# Altium schematic sheet 8_imu&debug_conn.SchDoc
size 431 x 279 mm; Organization: ORGANIZATION; Address1: ADDRESS 1; Address2: ADDRESS 2; Address3: ADDRESS 3; Address4: ADDRESS 4; Revision: -; ENG_APP_DATE: --/--/--; DSN_APP_DATE: --/--/--; CHK_APP_DATE: --/--/--
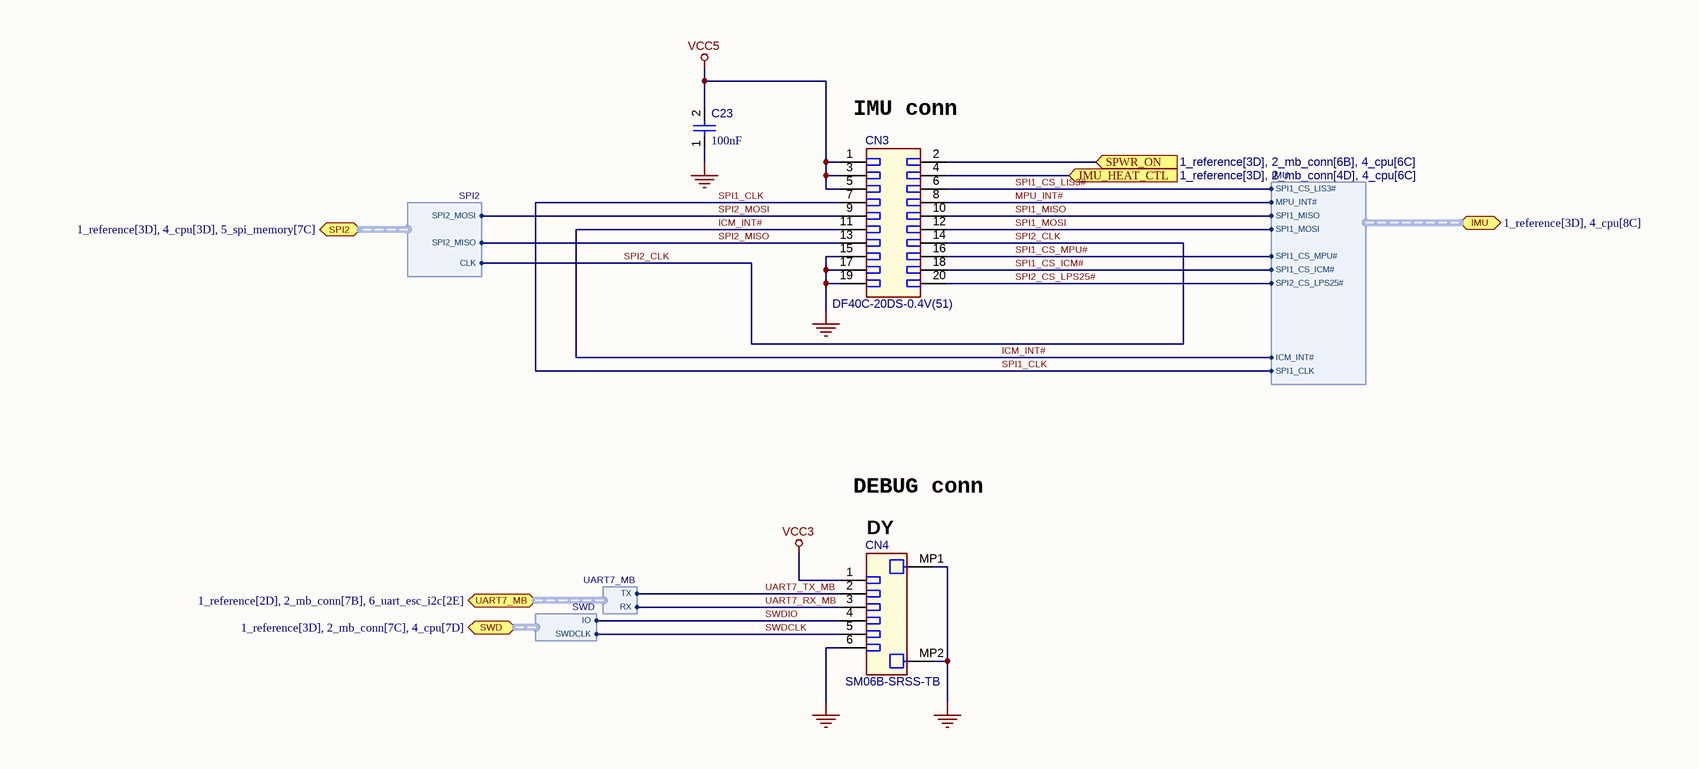
[diagram p0: 8_imu&debug_conn.SchDoc]

## Parts
C23  value 100nF  [CAPC0402(1005)60_L]  (hidden comment: Capacitor 100nF +/-20% 10V 0402)
CN3  DF40C-20DS-0.4V(51)  [HIRO-DF40C-20DS-0.4V(51)_V]
CN4  SM06B-SRSS-TB  [JST-SM06B-SRSS-TB_V]

## Ports
IMU (bidir, harness IMU, see 1_reference[3D], 4_cpu[8C]), IMU_HEAT_CTL (in, see 1_reference[3D], 2_mb_conn[4D], 4_cpu[6C]), SPI2 (bidir, harness SPI2, see 1_reference[3D], 4_cpu[3D], 5_spi_memory[7C]), SPWR_ON (in, see 1_reference[3D], 2_mb_conn[6B], 4_cpu[6C]), SWD (bidir, harness SWD, see 1_reference[3D], 2_mb_conn[7C], 4_cpu[7D]), UART7_MB (bidir, harness UART7_MB, see 1_reference[2D], 2_mb_conn[7B], 6_uart_esc_i2c[2E])

## Harnesses
IMU: SPI1_CS_LIS3#, MPU_INT#, SPI1_CLK, SPI1_MISO, SPI1_MOSI, ICM_INT#, SPI1_CS_MPU#, SPI1_CS_ICM#, SPI2_CS_LPS25#
SPI2: SPI2_MISO, CLK, SPI2_MOSI
UART7_MB: TX, RX
SWD: IO, SWDCLK

## Nets
GND: C23.1 CN3.15 CN3.17 CN3.19 CN4.6 CN4.MP1 CN4.MP2
VCC3: CN4.1
VCC5: C23.2 CN3.1 CN3.3 CN3.5
ICM_INT#: CN3.11 ; port IMU.ICM_INT#
IMU_HEAT_CTL: CN3.4 ; port IMU_HEAT_CTL
MPU_INT#: CN3.8 ; port IMU.MPU_INT#
SPI1_CLK: CN3.7 ; port IMU.SPI1_CLK
SPI1_CS_ICM#: CN3.18 ; port IMU.SPI1_CS_ICM#
SPI1_CS_LIS3#: CN3.6 ; port IMU.SPI1_CS_LIS3#
SPI1_CS_MPU#: CN3.16 ; port IMU.SPI1_CS_MPU#
SPI1_MISO: CN3.10 ; port IMU.SPI1_MISO
SPI1_MOSI: CN3.12 ; port IMU.SPI1_MOSI
SPI2_CLK: CN3.14 ; port SPI2.CLK
SPI2_CS_LPS25#: CN3.20 ; port IMU.SPI2_CS_LPS25#
SPI2_MISO: CN3.13 ; port SPI2.SPI2_MISO
SPI2_MOSI: CN3.9 ; port SPI2.SPI2_MOSI
SPWR_ON: CN3.2 ; port SPWR_ON
SWDCLK: CN4.5 ; port SWD.SWDCLK
SWDIO: CN4.4 ; port SWD.IO
UART7_RX_MB: CN4.3 ; port UART7_MB.RX
UART7_TX_MB: CN4.2 ; port UART7_MB.TX

## Notes on the sheet
- (near CN3) IMU conn
- DEBUG conn
- (near CN4) DY
- DWG. NO.
- REV.
- SHT.
- THIS DOCUMENT AND THE DATA DISCLOSED HEREIN OR HEREWITH IS THE PROPERTY OF ALTIUM LIMITED AND MAY BE FREELY DISTRIBUTED IN WHOLE. NO RIGHTS ARE RESERVED OR EXPRESS OR IMPLIED WARANTEE GIVEN.
- REVISION
- DESCRIPTION
- DATE
- APPROVED
- ENG:
- DSN:
- APPROVALS
- PROJECT REVISION:
- www.altium.com <http://www.altium.com>
- DOCUMENT REVISION:
- 92037, La Jolla
- USA
- Altium Ltd.
- 4225 Executive Square
- CHK:
- REFERENCE DOCUMENTS
- DESIGN ITEM:
- TITLE
- VARIANT
- BOM:
- FAB DWG:
- PCB DWG:
- ASSY DWG:
- SCALE:
- SIZE
- B
- CAGE CODE
- FILE NAME
- DWG NO.
- SHEET
- OF
- REV

## Library data of the parts
C23 = CMP-001-00061-2: Chip Capacitor, 100nF +/-20%, 10V, 0402, Thickness 0.6 mm; Tolerance: 20%; Min Operating Temperature: -55°C; Case/Package: 0402; Voltage Rating: 10V; Pins: 2; Mounting Technology: SMT; Max Operating Temperature: 85°C
CN3 = CMP-002-00059-2: Receptacle Connector, 30 V, 0.3 A, -35 to 85 degC, RoHS, Tape and Reel; Connector Type: Receptacle,CenterStripContacts; Pins: 20
CN4 = CMP-002-00060-2: Male Header, Pitch 1 mm, 1 x 6 Position, Height 2.95 mm, -25 to 85 degC, RoHS, Tape and Reel; Mounting Technology: SurfaceMount; Pins: 8; Case/Package: Male Header, Pitch 1 mm, 1 X 6 Position, Height 2.9 mm